# EAGLE design bleached (EAGLE 9.5.2)
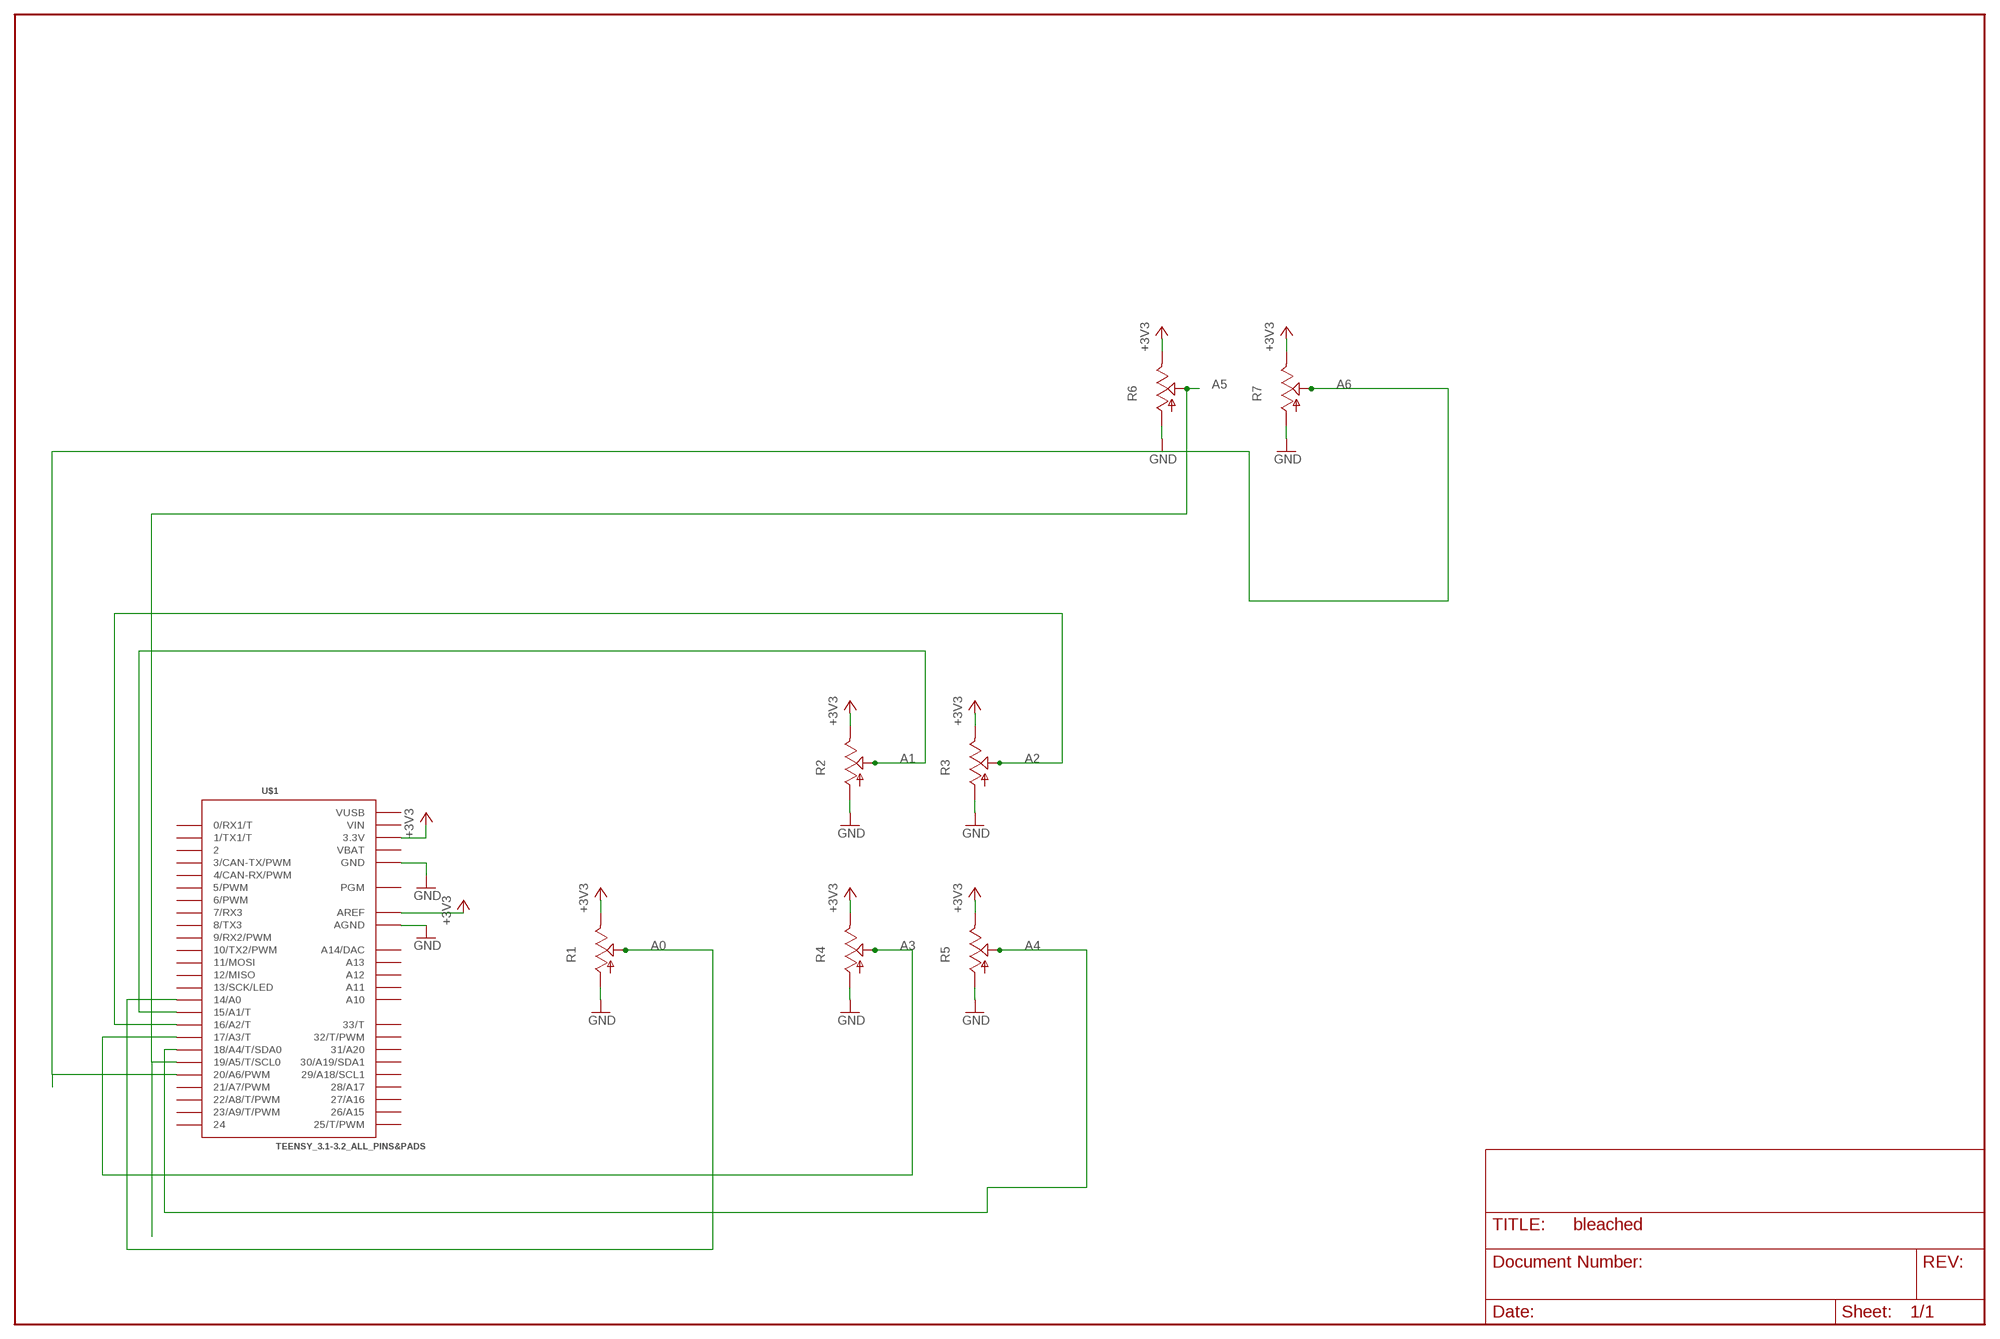
[diagram p0: schematic, sheet 1]

## Parts
R1  SHAPES_POT-ALPS_POT_USVERTICAL_PS  [SHAPES_POT-ALPS_ALPS_POT_VERTICAL_PS]
R2  SHAPES_POT-ALPS_POT_USVERTICAL_PS  [SHAPES_POT-ALPS_ALPS_POT_VERTICAL_PS]
R3  SHAPES_POT-ALPS_POT_USVERTICAL_PS  [SHAPES_POT-ALPS_ALPS_POT_VERTICAL_PS]
R4  SHAPES_POT-ALPS_POT_USVERTICAL_PS  [SHAPES_POT-ALPS_ALPS_POT_VERTICAL_PS]
R5  SHAPES_POT-ALPS_POT_USVERTICAL_PS  [SHAPES_POT-ALPS_ALPS_POT_VERTICAL_PS]
R6  SHAPES_POT-ALPS_POT_USVERTICAL_PS  [SHAPES_POT-ALPS_ALPS_POT_VERTICAL_PS]
R7  SHAPES_POT-ALPS_POT_USVERTICAL_PS  [SHAPES_POT-ALPS_ALPS_POT_VERTICAL_PS]
U$1  TEENSY_3.1-3.2_ALL_PINS&PADS  [TEENSY_3.0-3.2_ALL_PINS_&_PADS]

## Nets
+3V3: R1.P$1(E) R2.P$1(E) R3.P$1(E) R4.P$1(E) R5.P$1(E) R6.P$1(E) R7.P$1(E) U$1.3.3V U$1.3.3V1(3.3V) U$1.3.3V2(3.3V) U$1.AREF
A0: R1.P$2(S) U$1.14/A0
A1: R2.P$2(S) U$1.15/A1(15/A1/T)
A2: R3.P$2(S) U$1.16/A2(16/A2/T)
A3: R4.P$2(S) U$1.17/A3(17/A3/T)
A4: R5.P$2(S) U$1.18/A4(18/A4/T/SDA0)
A5: R6.P$2(S) U$1.19/A5(19/A5/T/SCL0)
A6: R7.P$2(S) U$1.20/A6(20/A6/PWM)
GND: R1.P$3(A) R2.P$3(A) R3.P$3(A) R4.P$3(A) R5.P$3(A) R6.P$3(A) R7.P$3(A) U$1.AGND U$1.GND U$1.GND1(GND) U$1.GND2(GND)
Unconnected: U$1.0(0/RX1/T) U$1.1(1/TX1/T) U$1.2 U$1.3(3/CAN-TX/PWM) U$1.4(4/CAN-RX/PWM) U$1.5(5/PWM) U$1.6(6/PWM) U$1.7(7/RX3) U$1.8(8/TX3) U$1.9(9/RX2/PWM) U$1.10(10/TX2/PWM) U$1.11(11/MOSI) U$1.12(12/MISO) U$1.13(13/SCK/LED) U$1.21/A7(21/A7/PWM) U$1.22/A8(22/A8/T/PWM) U$1.23/A9(23/A9/T/PWM) U$1.24 U$1.25(25/T/PWM) U$1.26(26/A15) U$1.27(27/A16) U$1.28(28/A17) U$1.29(29/A18/SCL1) U$1.30(30/A19/SDA1) U$1.31(31/A20) U$1.32(32/T/PWM) U$1.33(33/T) U$1.A10 U$1.A11 U$1.A12 U$1.A13 U$1.PGM U$1.RESET/DAC(A14/DAC)

## Power pins joined to a net without a drawn wire
VBAT: U$1.VBAT
VIN: U$1.VIN
VUSB: U$1.VUSB

## Library data of the parts
R1-R7 = monome_modular:SHAPES_POT-ALPS_POT_US
U$1 = Teensy_3_and_LC_Series_Boards_v1.4:TEENSY_3.1-3.2_ALL_PINS&PADS: Footprint for Teensy 3.1 or 3.2 board using all pads and all through-holes. Pads need a 2x7 0.1" SMD header.

## Board
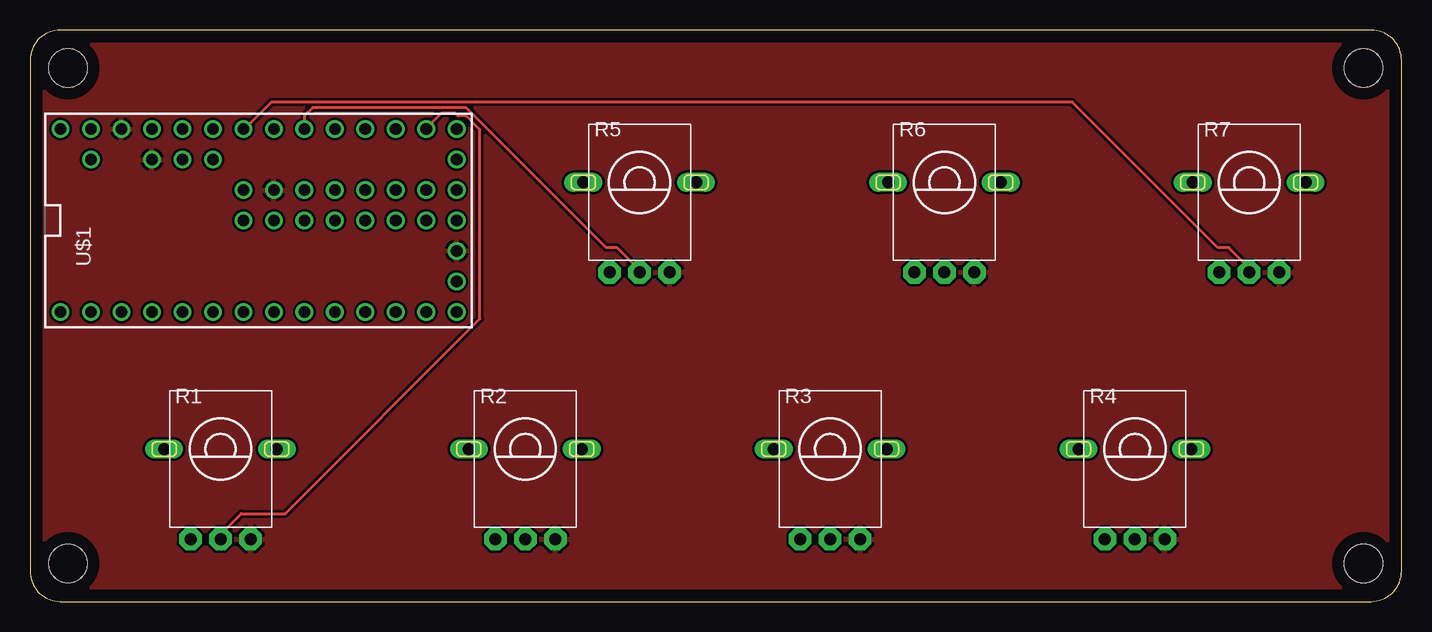
[diagram p1: board, top side]
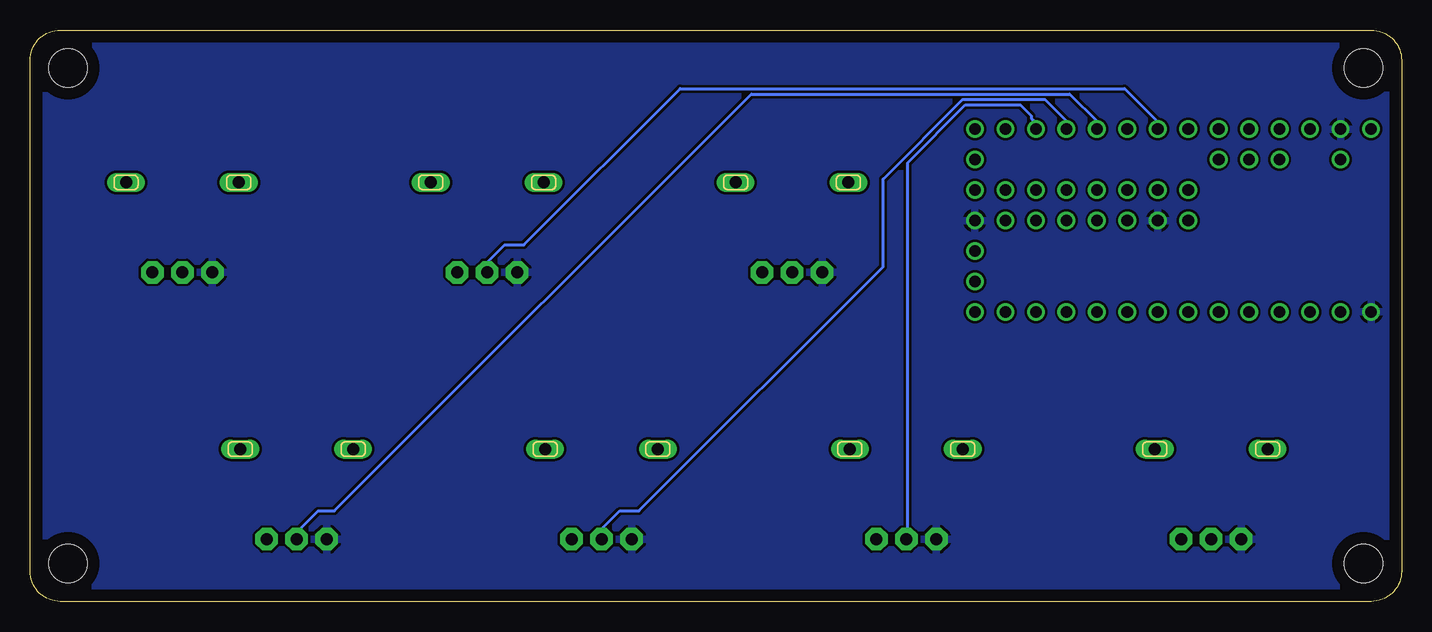
[diagram p2: board, bottom side, seen from below]

Size 114.3 x 47.62 mm. Coordinates in mm from the lower left corner, seen from the top.
Outline: 114.3,2.54 114.3,45.09 arc90 111.76,47.62 2.54,47.62 arc90 0,45.09 0,2.54 arc90 2.54,0 111.76,0 arc90 114.3,2.54
Copper layers (1*16): Top 0.035mm / dielectric 1.5mm / Bottom 0.035mm
Design rules "default": minimum track width 10mil, minimum drill 24mil, track to track 8mil, track to pad 8mil, pad to pad 8mil, via to via 8mil, smd to smd 8mil, copper to edge 40mil, drill to drill 8mil, minimum pad ring 10mil, minimum via ring 8mil, stop-mask expansion 4mil, vias tented up to drill 0mil, thermal gap 10mil
Holes 3.2 mm at 3.17,3.17 3.17,44.45 111.12,44.45 111.12,3.17

### Footprints (pad centres in the part's own frame; a part is rotated, then mirrored left to right if it is on the bottom)
SHAPES_POT-ALPS_ALPS_POT_VERTICAL_PS = drill 1 pad 1.88 octagon: P$1 -2.5,7.5; P$2 0,7.5; P$3 2.5,7.5 | drill 1 pad 1.6 long: P$4 -4.7,0; P$5 4.7,0
TEENSY_3.0-3.2_ALL_PINS_&_PADS = drill 0.965: 0 -7.62,13.97; 1 -7.62,11.43; 2 -7.62,8.89; 3 -7.62,6.35; 3.3V 7.62,11.43; 3.3V1 -2.54,-16.51; 3.3V2 2.54,-1.27; 4 -7.62,3.81; 5 -7.62,1.27; 6 -7.62,-1.27; 7 -7.62,-3.81; 8 -7.62,-6.35; 9 -7.62,-8.89; 10 -7.62,-11.43; 11 -7.62,-13.97; 12 -7.62,-16.51; 13 7.62,-16.51; 14/A0 7.62,-13.97; 15/A1 7.62,-11.43; 16/A2 7.62,-8.89; 17/A3 7.62,-6.35; 18/A4 7.62,-3.81; 19/A5 7.62,-1.27; 20/A6 7.62,1.27; 21/A7 7.62,3.81; 22/A8 7.62,6.35; 23/A9 7.62,8.89; 24 0,-3.81; 25 0,-6.35; 26 0,-8.89; 27 0,-11.43; 28 0,-13.97; 29 2.54,-13.97; 30 2.54,-11.43; 31 2.54,-8.89; 32 2.54,-6.35; 33 2.54,-3.81; A10 5.08,6.35; A11 5.08,3.81; A12 0,1.27; A13 2.54,1.27; AGND 7.62,13.97; AREF 5.08,8.89; GND -7.62,16.51; GND1 0,-16.51; GND2 0,-1.27; PGM 2.54,-16.51; RESET/DAC 5.08,-16.51; VBAT -5.08,-16.51; VIN 7.62,16.51; VUSB 5.08,13.97

### Placement (x,y rotation side)
R1  15.88,12.7 180 top
R2  41.27,12.7 180 top
R3  66.67,12.7 180 top
R4  92.08,12.7 180 top
R5  50.8,34.92 180 top
R6  76.2,34.92 180 top
R7  101.6,34.92 180 top
U$1  19.05,31.75 90 top

### Tracks (layer width: path | path; a pad name or v marks a point on that pad's centre or on a via)
+3V3
  pour Top: 114.3,2.54 114.3,45.09 arc90 111.76,47.62 2.54,47.62 arc90 0,45.09 0,2.54 arc90 2.54,0 111.76,0 arc90
A0
  Top 0.254: U$1.14/A0 33.15,39.55 34.29,40.69 35.43,40.69 35.66,40.46 36.35,40.46 37.49,39.32 37.49,23.55 21.26,7.32 17.6,7.32 16,5.71 16,5.26 R1.P$2
A1
  Bottom 0.254: U$1.15/A1 30.63,39.55 30.63,40.01 30.86,40.23 30.86,40.46 31.77,41.38 36.35,41.38 41.15,36.58 41.15,5.26 R2.P$2
A2
  Bottom 0.254: U$1.16/A2 27.89,39.55 27.89,40.01 29.72,41.83 36.58,41.83 43.2,35.2 43.2,27.89 63.55,7.54 65.15,7.54 66.52,6.17 66.52,5.26 R3.P$2
A3
  Bottom 0.254: U$1.17/A3 25.38,39.55 25.38,40.01 27.66,42.29 54.18,42.29 88.92,7.54 90.3,7.54 91.9,5.94 91.9,5.26 R4.P$2
A4
  Top 0.254: U$1.18/A4 22.86,40.46 23.55,41.15 36.35,41.15 48.01,29.49 48.92,29.49 50.98,27.43 R5.P$2
A5
  Bottom 0.254: U$1.19/A5 20.34,39.55 20.34,40.01 23.09,42.75 60.12,42.75 73.15,29.72 74.75,29.72 76.12,28.35 76.12,27.43 R6.P$2
A6
  Top 0.254: U$1.20/A6 17.83,39.55 18.06,39.55 20.12,41.6 86.87,41.6 98.98,29.49 99.9,29.49 101.5,27.89 101.5,27.43 R7.P$2
GND
  pour Bottom: 0,45.09 0,2.54 arc90 2.54,0 111.76,0 arc90 114.3,2.54 114.3,45.09 arc90 111.76,47.62 2.54,47.62 arc90